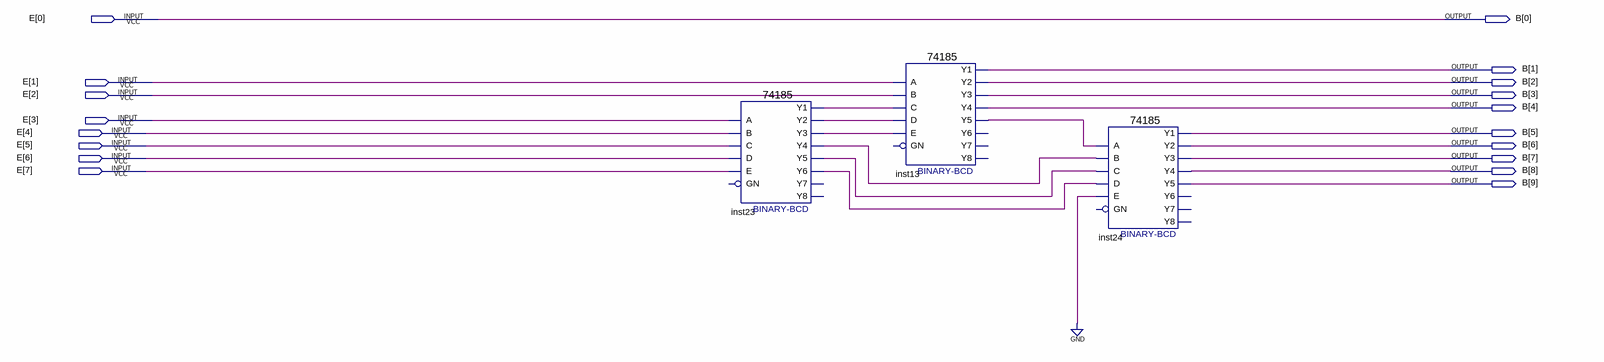
[diagram p0: schematic sheet]
// Quartus schematic display.bdf as structural Verilog: 3 symbols, 18 pins
module display (
  input  [7:0] E,
  output [9:0] B
);

  wire inst13_y5, inst23_y1, inst23_y2, inst23_y3, inst23_y4, inst23_y5, inst23_y6;

  \74185  inst23 (
    .A(E[3]), .B(E[4]), .D(E[6]), .C(E[5]), .E(E[7]), .Y1(inst23_y1), .Y3(inst23_y3), .Y2(inst23_y2),
    .Y5(inst23_y5), .Y4(inst23_y4), .Y6(inst23_y6));  // open: GN, Y8, Y7
  \74185  inst13 (
    .A(E[1]), .B(E[2]), .D(inst23_y2), .C(inst23_y1), .E(inst23_y3), .Y1(B[1]), .Y3(B[3]), .Y2(B[2]),
    .Y5(inst13_y5), .Y4(B[4]));  // open: GN, Y6, Y8, Y7
  \74185  inst24 (
    .A(inst13_y5), .B(inst23_y4), .D(inst23_y6), .C(inst23_y5), .E(1'b0), .Y1(B[5]), .Y3(B[7]), .Y2(B[6]),
    .Y5(B[9]), .Y4(B[8]));  // open: GN, Y6, Y8, Y7

  assign B[0] = E[0];
endmodule
